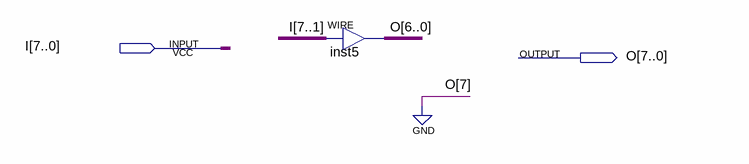
[diagram p0: schematic sheet]
// Quartus schematic ShR_1b.bdf as structural Verilog: 1 symbols, 2 pins
module ShR_1b (
  input  [7:0] I,
  output [7:0] O
);

  assign O[6:0] = I[7:1];  // WIRE inst5

  assign O[7] = 1'b0;
endmodule
